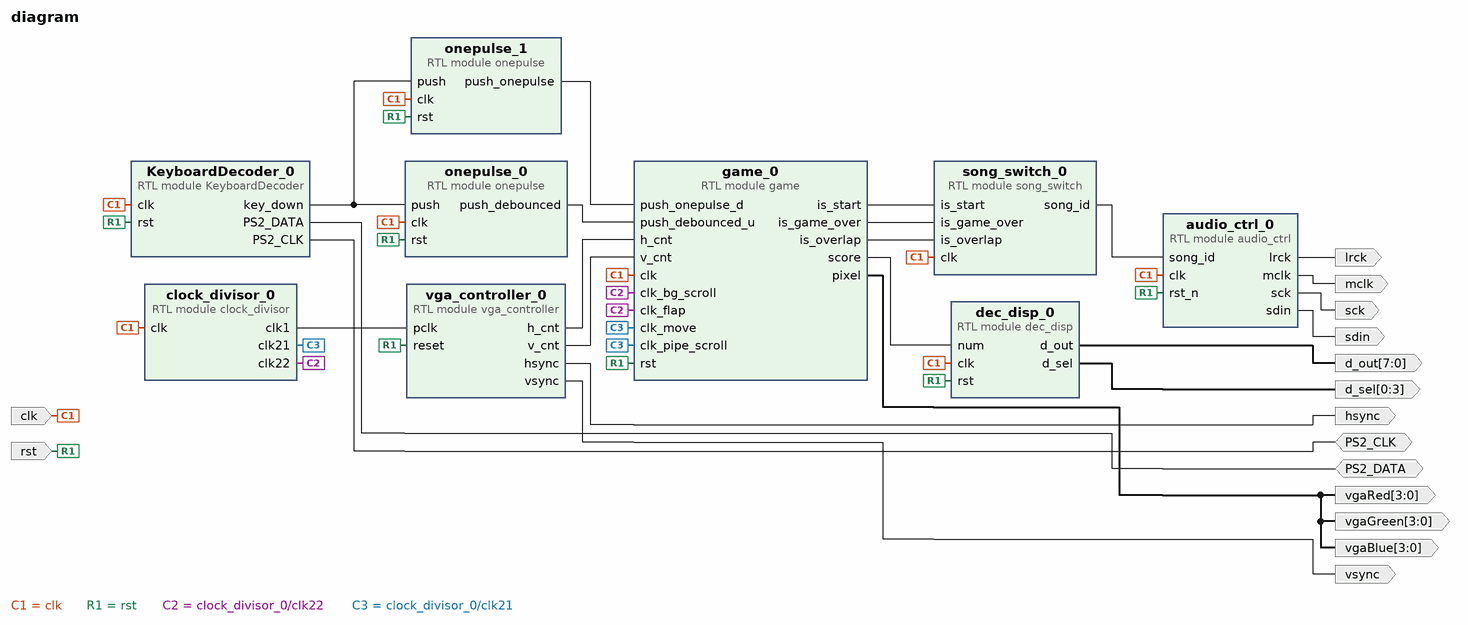
[diagram p0: block diagram of the top level]
# Vivado block design diagram, xc7a35tcpg236-1, Vivado 2019.2
create_bd_design diagram

create_bd_port -dir I clk
create_bd_port -dir I rst
create_bd_port -dir IO PS2_DATA
create_bd_port -dir IO PS2_CLK
create_bd_port -dir O hsync
create_bd_port -dir O vsync
create_bd_port -dir O mclk
create_bd_port -dir O lrck
create_bd_port -dir O sck
create_bd_port -dir O sdin
create_bd_port -dir O -from 3 -to 0 vgaRed
create_bd_port -dir O -from 3 -to 0 vgaBlue
create_bd_port -dir O -from 3 -to 0 vgaGreen
create_bd_port -dir O -from 7 -to 0 d_out
create_bd_port -dir O -from 0 -to 3 d_sel

create_bd_cell -type module -reference game game_0
set_property -dict [list \
  CONFIG.CNT_BITS_N 10 \
  CONFIG.HEIGHT_CNT 240 \
  CONFIG.MEM_DATA_BIT_N 12 \
  CONFIG.PX_ADDR_BITS_N 17 \
  CONFIG.SCORE_BITS_N 14 \
  CONFIG.WIDTH_CNT 320 \
] [get_bd_cells game_0]
create_bd_cell -type module -reference audio_ctrl audio_ctrl_0
create_bd_cell -type module -reference dec_disp dec_disp_0
create_bd_cell -type module -reference onepulse onepulse_0
create_bd_cell -type module -reference KeyboardDecoder KeyboardDecoder_0
create_bd_cell -type module -reference clock_divisor clock_divisor_0
create_bd_cell -type module -reference onepulse onepulse_1
create_bd_cell -type module -reference song_switch song_switch_0
create_bd_cell -type module -reference vga_controller vga_controller_0

# ---- connections ----

connect_bd_net [get_bd_ports clk] \
  [get_bd_pins clock_divisor_0/clk] [get_bd_pins game_0/clk] [get_bd_pins onepulse_0/clk] [get_bd_pins onepulse_1/clk] \
  [get_bd_pins KeyboardDecoder_0/clk] [get_bd_pins song_switch_0/clk] [get_bd_pins dec_disp_0/clk] \
  [get_bd_pins audio_ctrl_0/clk]
connect_bd_net [get_bd_ports rst] \
  [get_bd_pins onepulse_1/rst] [get_bd_pins onepulse_0/rst] [get_bd_pins KeyboardDecoder_0/rst] [get_bd_pins game_0/rst] \
  [get_bd_pins vga_controller_0/reset] [get_bd_pins dec_disp_0/rst] [get_bd_pins audio_ctrl_0/rst_n]
connect_bd_net [get_bd_pins KeyboardDecoder_0/key_down] [get_bd_pins onepulse_0/push] [get_bd_pins onepulse_1/push]
connect_bd_net [get_bd_pins onepulse_0/push_debounced] [get_bd_pins game_0/push_debounced_u]
connect_bd_net [get_bd_pins onepulse_1/push_onepulse] [get_bd_pins game_0/push_onepulse_d]
connect_bd_net [get_bd_pins clock_divisor_0/clk22] [get_bd_pins game_0/clk_bg_scroll] [get_bd_pins game_0/clk_flap]
connect_bd_net [get_bd_pins clock_divisor_0/clk21] [get_bd_pins game_0/clk_pipe_scroll] [get_bd_pins game_0/clk_move]
connect_bd_net [get_bd_pins game_0/is_start] [get_bd_pins song_switch_0/is_start]
connect_bd_net [get_bd_pins game_0/is_game_over] [get_bd_pins song_switch_0/is_game_over]
connect_bd_net [get_bd_pins game_0/is_overlap] [get_bd_pins song_switch_0/is_overlap]
connect_bd_net [get_bd_pins game_0/score] [get_bd_pins dec_disp_0/num]
connect_bd_net [get_bd_pins clock_divisor_0/clk1] [get_bd_pins vga_controller_0/pclk]
connect_bd_net [get_bd_pins song_switch_0/song_id] [get_bd_pins audio_ctrl_0/song_id]
connect_bd_net [get_bd_ports PS2_DATA] [get_bd_pins KeyboardDecoder_0/PS2_DATA]
connect_bd_net [get_bd_ports PS2_CLK] [get_bd_pins KeyboardDecoder_0/PS2_CLK]
connect_bd_net [get_bd_pins vga_controller_0/hsync] [get_bd_ports hsync]
connect_bd_net [get_bd_pins vga_controller_0/vsync] [get_bd_ports vsync]
connect_bd_net [get_bd_pins audio_ctrl_0/mclk] [get_bd_ports mclk]
connect_bd_net [get_bd_pins audio_ctrl_0/lrck] [get_bd_ports lrck]
connect_bd_net [get_bd_pins audio_ctrl_0/sck] [get_bd_ports sck]
connect_bd_net [get_bd_pins audio_ctrl_0/sdin] [get_bd_ports sdin]
connect_bd_net [get_bd_pins game_0/pixel] [get_bd_ports vgaRed] [get_bd_ports vgaBlue] [get_bd_ports vgaGreen]
connect_bd_net [get_bd_pins vga_controller_0/h_cnt] [get_bd_pins game_0/h_cnt]
connect_bd_net [get_bd_pins vga_controller_0/v_cnt] [get_bd_pins game_0/v_cnt]
connect_bd_net [get_bd_pins dec_disp_0/d_out] [get_bd_ports d_out]
connect_bd_net [get_bd_pins dec_disp_0/d_sel] [get_bd_ports d_sel]

validate_bd_design
save_bd_design
